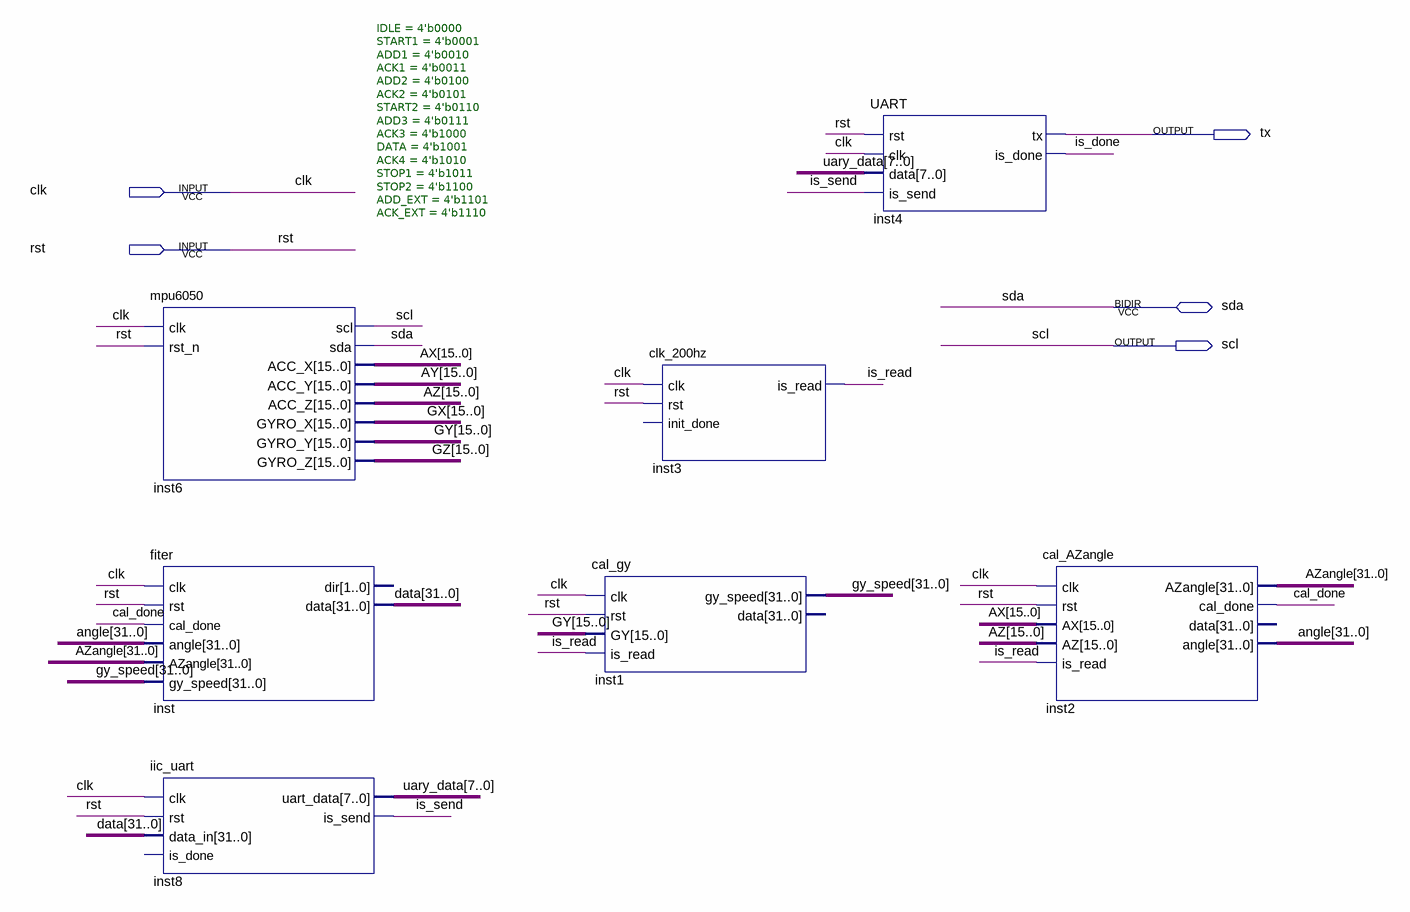
[diagram p0: schematic sheet]
// Quartus schematic GY521.bdf as structural Verilog: 7 symbols, 5 pins
module GY521 (
  input  clk,
  input  rst,
  inout  sda,
  output tx,
  output scl
);

  wire cal_done, is_done, is_read, is_send;
  wire [7:0] uary_data;
  wire [15:0] AX, AY, AZ, GX, GY, GZ;
  wire [31:0] angle, AZangle, data, gy_speed;

  mpu6050 #(.IDLE(4'b0000), .START1(4'b0001), .ADD1(4'b0010), .ACK1(4'b0011), .ADD2(4'b0100), .ACK2(4'b0101), .START2(4'b0110), .ADD3(4'b0111), .ACK3(4'b1000), .DATA(4'b1001), .ACK4(4'b1010), .STOP1(4'b1011), .STOP2(4'b1100), .ADD_EXT(4'b1101), .ACK_EXT(4'b1110)) inst6 (
    .clk(clk), .rst_n(rst), .scl(scl), .ACC_X(AX), .ACC_Y(AY), .ACC_Z(AZ), .GYRO_X(GX), .GYRO_Y(GY),
    .GYRO_Z(GZ), .sda(sda));
  fiter inst (
    .clk(clk), .rst(rst), .cal_done(cal_done), .angle(angle), .AZangle(AZangle), .gy_speed(gy_speed),
    .data(data));  // open: dir
  iic_uart inst8 (.clk(clk), .rst(rst), .data_in(data), .uart_data(uary_data), .is_send(is_send));  // open: is_done
  cal_gy inst1 (.clk(clk), .rst(rst), .GY(GY), .is_read(is_read), .gy_speed(gy_speed));  // open: data
  clk_200hz inst3 (.clk(clk), .rst(rst), .is_read(is_read));  // open: init_done
  UART inst4 (.rst(rst), .clk(clk), .data(uary_data), .is_send(is_send), .tx(tx), .is_done(is_done));
  cal_AZangle inst2 (
    .clk(clk), .rst(rst), .AX(AX), .AZ(AZ), .is_read(is_read), .AZangle(AZangle), .cal_done(cal_done),
    .angle(angle));  // open: data
endmodule
